# Altium schematic sheet 464HardwareProject.SchDoc
size A4; SheetNumber: 1; SheetTotal: 1
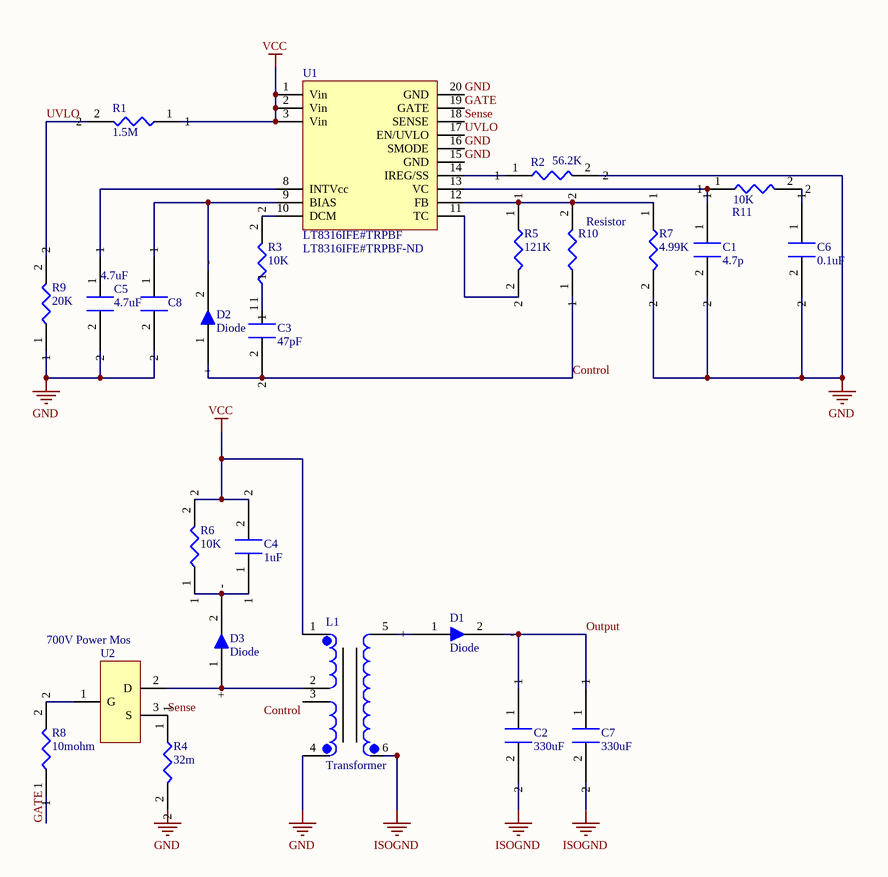
[diagram p0: 464HardwareProject.SchDoc]

## Parts
C1  4.7p  [C1 C0402 47pF]
C2  330uF  [C2 Output Cap 330uF 16V 13mohm]
C3  47pF  [C3 C0402 47pF 100V]
C4  1uF  [C6 C0402 1uF]
C5  4.7uF  [C6 C0402 1uF]
C6  0.1uF  [C6 C0402 1uF]
C7  330uF  [C2 Output Cap 330uF 16V 13mohm]
C8  4.7uF  [C4 C0402 4.7uF 16V]
D1  Diode  [D1 40A 860 mv TO220-2]
D2  Diode  [D2 1A 470mV SOD323-2]
D3  Diode  [D3 5A 1.15V DO-214AB]
L1  Transformer  [Transformer]
R1  1.5M  [R1 R0402 1.5M 0.2W]
R2  56.2K  [R2 R0402 56.2K]
R3  10K  [R3 R0805 10K 1W wide-chip]
R4  32m  [R4 R0603 32mohm sense]
R5  121K  [R5 R0402 121K]
R6  10K  [R11 R3540 10K 4W snubber]
R7  4.99K  [R7 R0402 4.99K]
R8  10mohm  [R10 R0402 10mohm gate]
R9  20K  [R9 R0402 20K]
R10  Resistor  [R6 R0402 44.2K 0.25W]
R11  10K  [R8 R0402 10K]
U1  LT8316IFE#TRPBF  Supplier Part Number 1: LT8316IFE#TRPBF-ND  [LT8316]
U2  700V Power Mos  [700V mos]

## Nets
GND: C1.2 C5.2 C6.2 C8.2 L1.4(L3-) R2.2 R4.2 R7.2 R9.1 U1.15(GND) U1.16(SMODE) U1.20(GND)
ISOGND: C2.2 C7.2 L1.6(L2-)
VCC: C4.2 L1.1(L1_+) R1.1 R6.2 U1.1(Vin) U1.2(Vin) U1.3(Vin)
Control: C3.2 D2.1(+) L1.3(L3+) R10.1
GATE: R8.1 U1.19(GATE)
Output: C2.1 C7.1 D1.2(-)
Sense: R4.1 U1.18(SENSE) U2.3(S)
UVLO: R1.2 R9.2 U1.17(EN/UVLO)
NetC1_1: C1.1 R11.1 U1.13(VC)
NetC3_1: C3.1 R3.1
NetC4_1: C4.1 D3.2(-) R6.1
NetC5_1: C5.1 U1.8(INTVcc)
NetC6_1: C6.1 R11.2
NetC8_1: C8.1 D2.2(-) U1.9(BIAS)
NetD1_1: D1.1(+) L1.5(L2+)
NetD3_1: D3.1(+) L1.2(L1_-) U2.2(D)
NetR2_1: R2.1 U1.14(IREG/SS)
NetR3_2: R3.2 U1.10(DCM)
NetR5_1: R5.1 R7.1 R10.2 U1.12(FB)
NetR5_2: R5.2 U1.11(TC)
NetR8_2: R8.2 U2.1(G)

## Library data of the parts
C1-C8 = Capacitor
R1-R9 R11 = Resistor
U1 = LT8316IFE#TRPBF: DC/DC Cntrlr Single-OUT 142kHz Automotive 16-Pin TSSOP EP T/R; Manufacturer: Analog Devices; Supplier 1: Digi-Key; Manufacturer Part Number: LT8316IFE#TRPBF; Pricing 1: 2500=3,34500 (USD)